# EasyEDA Pro project 136khz_RX_2025-06-18.epro

# Schematic mianSch
Board Name: mianPCB; Create Date: 2025-06-06; Page Name: P1; Project Name: 136khz RX; Schematic Name: mianSch; Update Date: 2025-06-14; Company: 嘉立创EDA; Drawed: BH3PTS; Page Size: A4; Version: V1.0
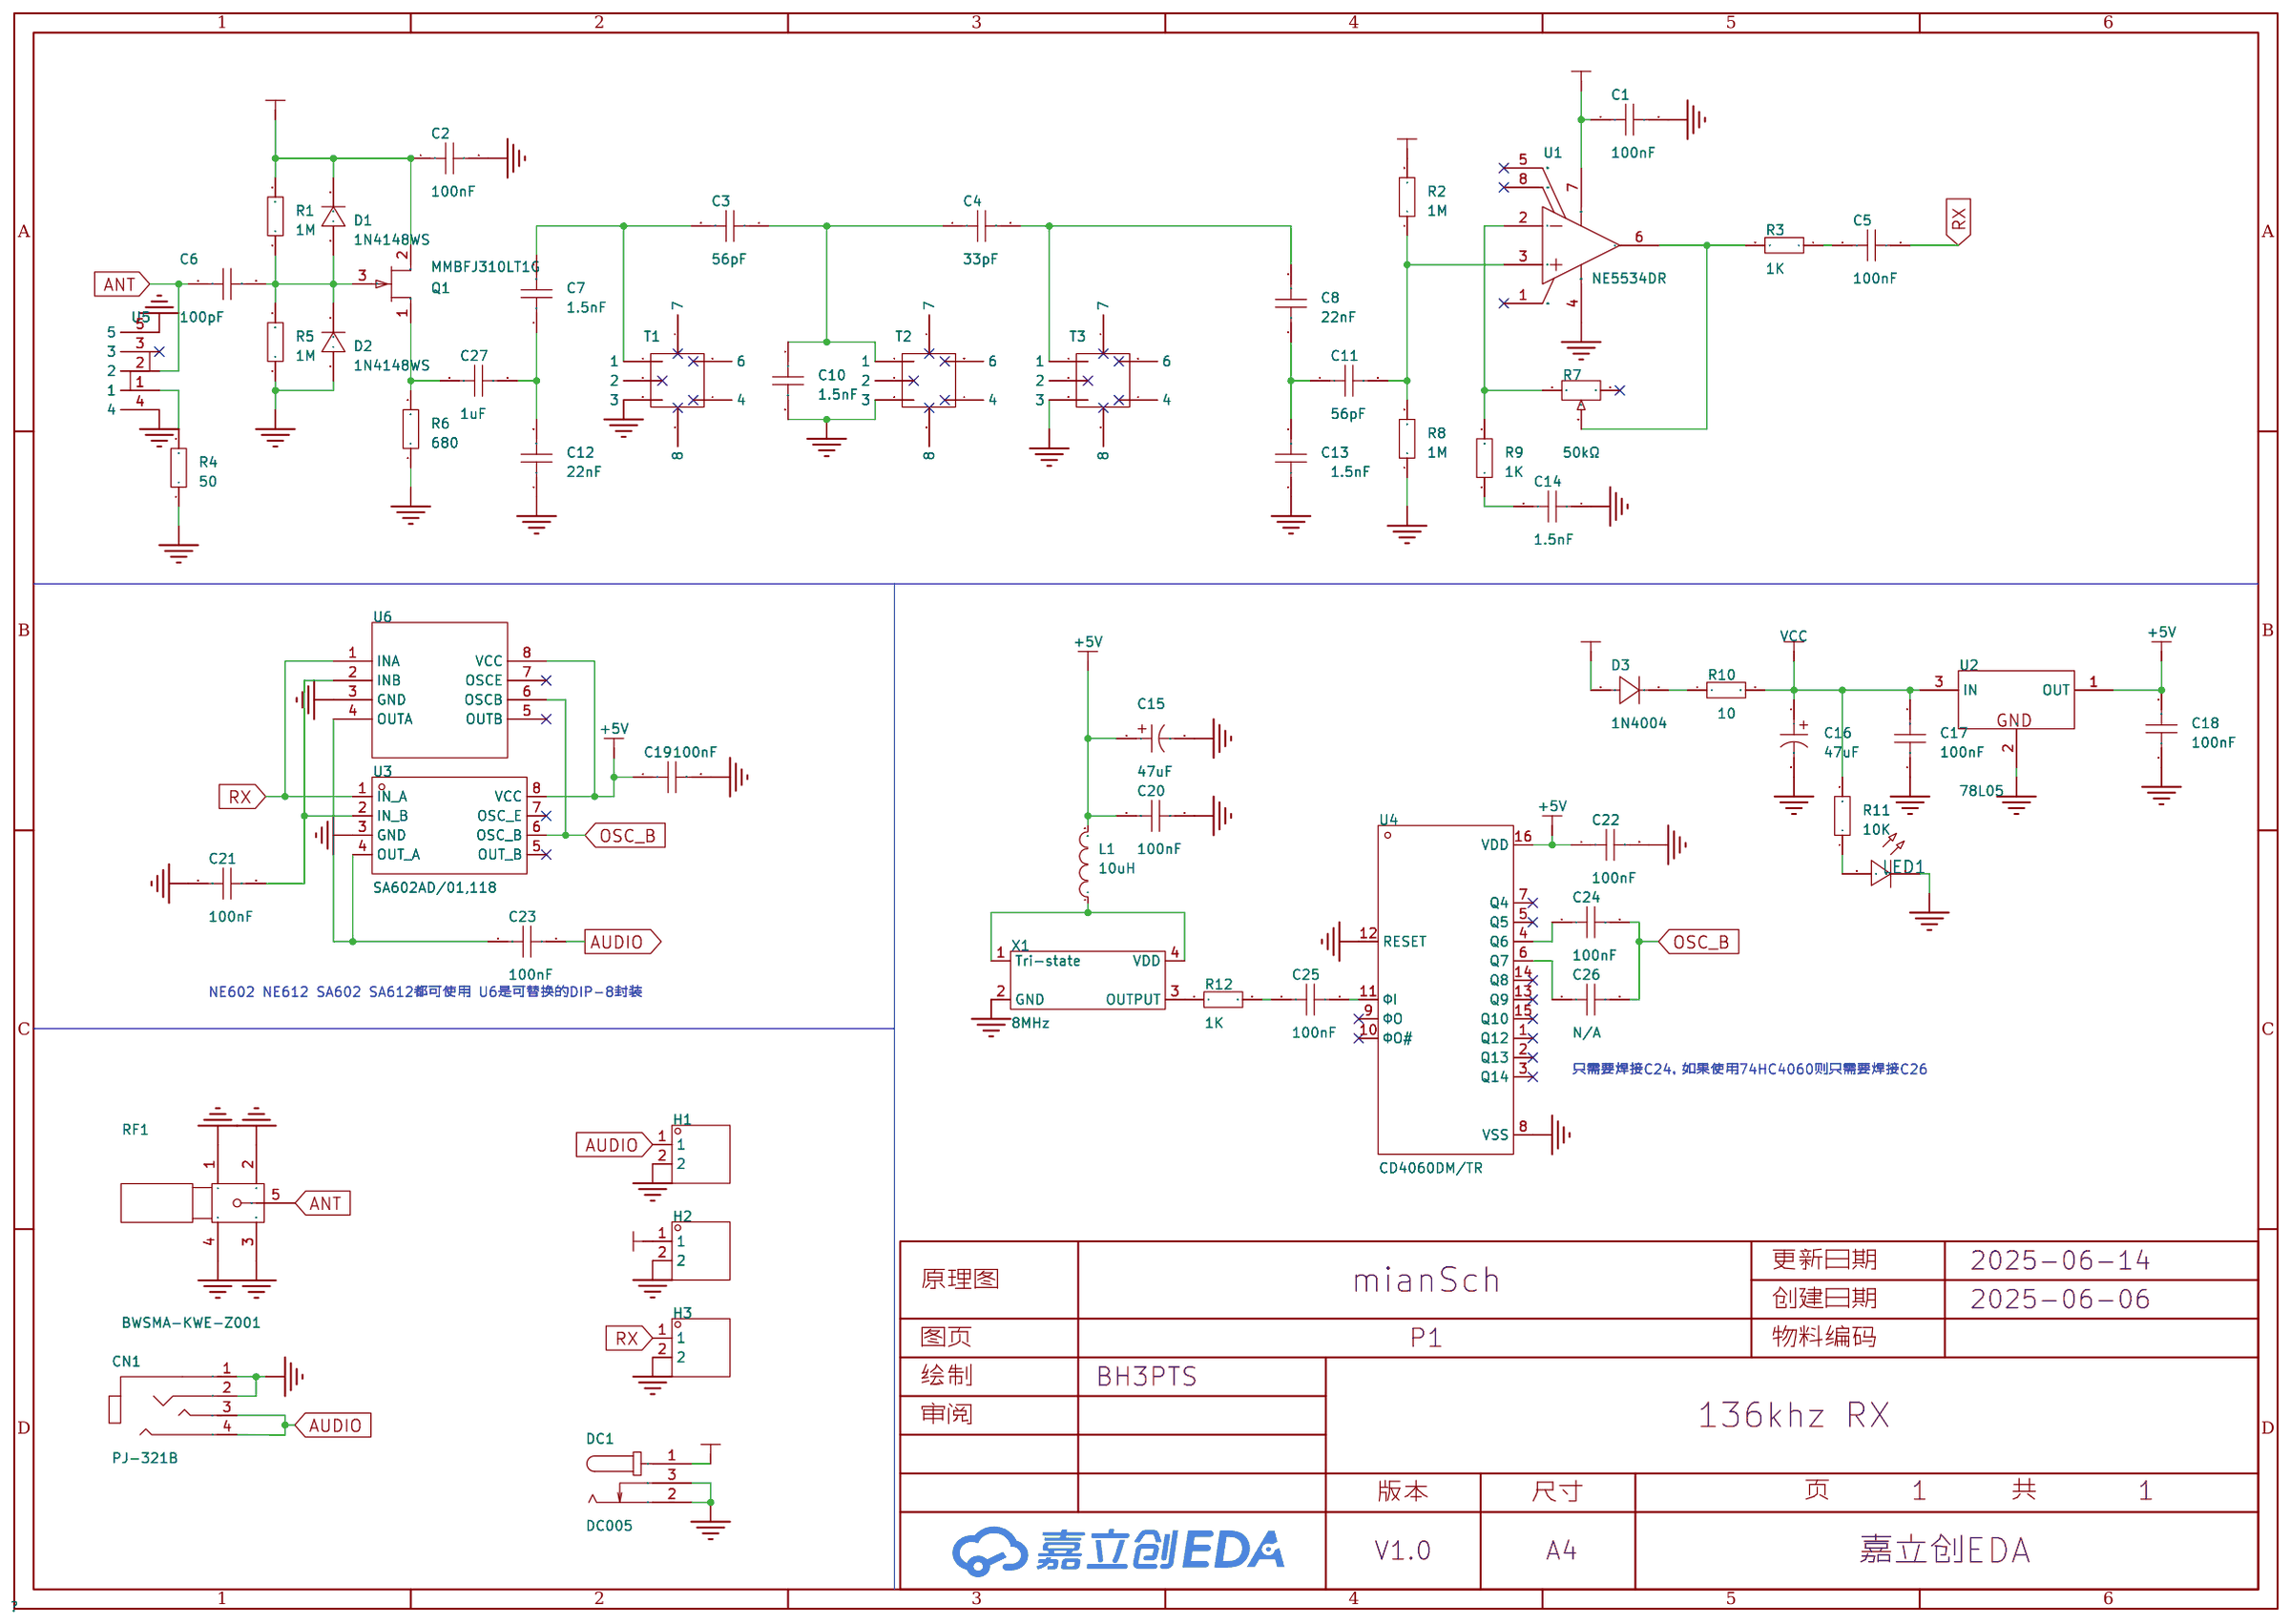
[diagram p0: schematic sheet]

## Parts
C1  100nF  [C0603]
C2  100nF  [C0603]
C3  56pF  [C0603]
C4  33pF  [C0603]
C5  100nF  [C0603]
C6  100pF  [C0603]
C7  1.5nF  [C0603]
C8  22nF  [C0603]
C10  1.5nF  [C0603]
C11  56pF  [C0603]
C12  22nF  [C0603]
C13  1.5nF  [C0603]
C14  1.5nF  [C0603]
C15  47uF  [CAP-SMD_BD6.3-L6.6-W6.6-LS7.2-FD]
C16  47uF  [CAP-SMD_BD6.3-L6.6-W6.6-LS7.2-FD]
C17  100nF  [C0603]
C18  100nF  [C0603]
C19  100nF  [C0603]
C20  100nF  [C0603]
C21  100nF  [C0603]
C22  100nF  [C0603]
C23  100nF  [C0603]
C24  100nF  [C0603]
C25  100nF  [C0603]
C26  N/A  [C0603]
C27  1uF  [C0805]
CN1  PJ-321B  [AUDIO-TH_PJ-321B]
D1  1N4148WS  [SOD-323_L1.8-W1.3-LS2.5-RD]
D2  1N4148WS  [SOD-323_L1.8-W1.3-LS2.5-RD]
D3  1N4004  [SMA_L4.4-W2.8-LS5.4-RD]
DC1  DC005  [DC-IN-TH_DC005]
H1  -  [HDR-TH_2P-P2.54-V-M-1]
H2  -  [HDR-TH_2P-P2.54-V-M-1]
H3  -  [HDR-TH_2P-P2.54-V-M-1]
L1  10uH  [L0603]
LED1  -  [LED_0603]
Q1  MMBFJ310LT1G  [SOT-23-3_L2.9-W1.6-P1.90-LS2.8-BR]
R1  1M  [R0603]
R2  1M  [R0603]
R3  1K  [R0603]
R4  50  [R0805]
R5  1M  [R0603]
R6  680  [R0603]
R7  50kΩ  [RES-ADJ-TH_3P-L7.1-W6.9-P2.50-L_3362P]
R8  1M  [R0603]
R9  1K  [R0603]
R10  10  [R1206]
R11  10K  [R0603]
R12  1K  [R0603]
RF1  BWSMA-KWE-Z001  [SMA-TH_BWSMA-KWE-Z001]
T1  -  [TP702]
T2  -  [TP702]
T3  -  [TP702]
U1  NE5534DR  [SOIC-8_L5.0-W4.0-P1.27-LS6.0-BL]
U2  78L05  [SOT-89-3_L4.5-W2.5-P1.50-LS4.2-BR]
U3  SA602AD/01,118  [SOP-8_L4.9-W3.9-P1.27-LS6.0-BL]
U4  CD4060DM/TR  [SOP-16_L9.9-W3.9-P1.27-LS6.0-BL]
U5  -  [SS-12D07G3]
U6  -  [DIP-8_L9.2-W6.4-P2.54-LS7.6-BL]
X1  8MHz  [OSC-SMD_4P-L3.2-W2.5-BL]

## Library data of the parts
C1-C8 C10-C14 C17-C26 = CAP_0603: Supplier Footprint: 0603
C15 C16 = RVT47UF35V67RV0039: 容值:47uF;精度:±20%;额定电压:35V;纹波电流:16.4mA@120Hz;等效串联电阻(ESR):-;; LCSC Part Name: 47uF ±20% 35V; Supplier Part: C2836440; Manufacturer: KNSCHA(科尼盛); Supplier Footprint: SMD,D6.3xL5.4mm; JLCPCB Part Class: 扩展库; Datasheet: https://atta.szlcsc.com/upload/public/pdf/source/20210528/C2836440_FB61BB3A7A46B9CC2A608A35871DBF0C.pdf; Supplier: LCSC; Tolerance: ±20%; Voltage Rating: 35V; Ripple Current: 16.4mA@120Hz; Diameter: 6.3mm; Height - Seated (Max): 5.4mm; Lifetime: 2000hrs@105℃; Operating Temperature: -55℃~+105℃
C27 = CAP_0805: Supplier Footprint: 0805
CN1 = PJ-321B: 连接器类型:3.5mm耳机座;额定电流:500mA;额定电压:30V;工作温度范围:-20℃~+70℃;焊接温度(最大值):235℃;; LCSC Part Name: 3.5mm耳机座; Supplier Part: C692436; Manufacturer: XKB Connection(中国星坤); Supplier Footprint: 插件; JLCPCB Part Class: 扩展库; Datasheet: https://atta.szlcsc.com/upload/public/pdf/source/20211011/0B12C1EC3FF575692CC2E8C172D7F9F9.pdf; Supplier: LCSC; Connector Type: 3.5mm耳机座; Current Rating (Max): 500mA; Voltage Rating (Max): 30V; Operating Temperature Range: -20℃~+70℃; Soldering Temperature(Max): 235℃
D1 D2 = 1N4148WS_C2128: 二极管配置:独立式;正向压降(Vf):1.25V@150mA;直流反向耐压(Vr):100V;整流电流:150mA;反向恢复时间(trr):4ns;; LCSC Part Name: 电压:100V 电流:150mA; Supplier Part: C2128; Manufacturer: CJ(江苏长电/长晶); Supplier Footprint: SOD-323; JLCPCB Part Class: 基础库; Datasheet: https://atta.szlcsc.com/upload/public/pdf/source/20140809/1457707208178.pdf; Supplier: LCSC; Diode Configuration: 独立式; Forward Voltage (Vf@If): 1.25V@150mA; Reverse Voltage (Vr): 100V; Rectified Current: 150mA; Reverse Leakage Current: 1uA@75V; Reverse Recovery Time (trr): 4ns
D3 = 1N4004_C727080: 二极管配置:独立式;正向压降(Vf):1.1V@1A;直流反向耐压(Vr):400V;整流电流:1A;; LCSC Part Name: 电压:400V 电流:1A; Supplier Part: C727080; Manufacturer: TWGMC(台湾迪嘉); Supplier Footprint: SMA(DO-214AC); JLCPCB Part Class: 扩展库; Datasheet: https://atta.szlcsc.com/upload/public/pdf/source/20200828/C727079_3A05254382567072883400655AE0ED46.pdf; Supplier: LCSC; Diode Configuration: 独立式; Forward Voltage (Vf@If): 1.1V@1A; Reverse Voltage (Vr): 400V; Rectified Current: 1A; Reverse Leakage Current: 5uA
DC1 = DC005: 连接器类型:DC电源插座;安装方式:弯插;触点内径:2mm;触点外径:6.3mm;额定电流:500mA;额定电压:30V;工作温度范围:-25℃~+70℃;; LCSC Part Name: DC电源插座 内径:2mm 外径:6.3mm; Supplier Part: C431533; Manufacturer: SHOU HAN(首韩); Supplier Footprint: 插件; JLCPCB Part Class: 扩展库; Datasheet: https://atta.szlcsc.com/upload/public/pdf/source/20190925/C431533_4751811035784AC1D38EBC85F7905E99.pdf; Supplier: LCSC; Connector Type: DC电源插座; Mounting Style: 弯插; Inside Contact Diameter: 2mm; Outside Contact Diameter: 6.3mm; Current Rating (Max): 500mA; Voltage Rating (Max): 30V; Operating Temperature Range: -25℃~+70℃
H1-H3 = HDR-M_2.54_1x2P: Supplier Part: C124375; Supplier Footprint: 插件
L1 = SDFL1608S100KTF: 电感值:10uH;精度:±10%;额定电流:3mA;饱和电流(Isat):-;直流电阻(DCR):1.85Ω;; LCSC Part Name: 10uH ±10%; Supplier Part: C1035; Manufacturer: Sunlord(顺络); Supplier Footprint: 0603; JLCPCB Part Class: 基础库; Datasheet: https://atta.szlcsc.com/upload/public/pdf/source/20231027/097A17DDB71564CE812E62F0F80142C9.pdf; Supplier: LCSC; Tolerance: ±10%; Rated Current: 3mA; DC Resistance(DCR): 1.85Ω; Q @ Frequency: 30@2MHz; Frequency - Self Resonant: 17MHz
LED1 = LED_0603-R: Supplier Footprint: 0603
Q1 = MMBFJ310LT1G: FET类型:N沟道;栅源击穿电压(V(BR)GSS):-;功率(Pd):-;漏源导通电阻(RDS(on)):-;饱和漏源电流(Idss@Vds,Vgs=0):-;; Supplier Part: C33416; Manufacturer: onsemi(安森美); Supplier Footprint: SOT-23; JLCPCB Part Class: 扩展库; Datasheet: https://atta.szlcsc.com/upload/public/pdf/source/20150912/1457707362458.pdf; Supplier: LCSC; FET Type: N沟道
R1-R3 R5 R6 R8 R9 R11 R12 = Res_0603: Supplier Footprint: 0603
R4 = Res_0805: Supplier Footprint: 0805
R7 = 3362P-1-503: 阻值:50kΩ;精度:±10%;; LCSC Part Name: 50kΩ ±10%; Supplier Part: C118910; Manufacturer: BOCHEN(博晨); Supplier Footprint: 插件; JLCPCB Part Class: 扩展库; Datasheet: https://atta.szlcsc.com/upload/public/pdf/source/20171114/C118910_15106326554621117400.pdf; Supplier: LCSC; Tolerance: ±10%
R10 = Res_1206: Supplier Footprint: 1206
RF1 = BWSMA-KWE-Z001: 连接器类型:板端;接口类型:内孔;端口数量:1;接口直径:5.3mm;接口长度/高度:-;频率-最大值:-;射频系列:SMA;阻抗:50Ω;样式:弯头;触头材质:-;触头镀层:-;工作温度范围:-;焊接温度(最大值):-;; LCSC Part Name: 内孔 SMA 弯头; Supplier Part: C496551; Manufacturer: BAT WIRELESS(蝙蝠无线); Supplier Footprint: 插件; JLCPCB Part Class: 扩展库; Datasheet: https://atta.szlcsc.com/upload/public/pdf/source/20231017/997A8C2ADA7F8034A89BE1264F38CE52.pdf; Supplier: LCSC; Connector Type: 板端; Interface Type: 内孔; Number of Ports: 1; Interface Diameter: 5.3mm; RF Series: SMA; Impedance: 50Ω; Style: 弯头
T1-T3 = TP702
U1 = NE5534DR: 放大器数:单路;轨到轨:-;增益带宽积(GBP):-;输入失调电压(Vos):4mV;压摆率(SR):13V/us;输入偏置电流(Ib):1.5uA;; Supplier Part: C9916; Manufacturer: TI(德州仪器); Supplier Footprint: SOIC-8; JLCPCB Part Class: 扩展库; Datasheet: https://www.ti.com/cn/lit/gpn/ne5534; Supplier: LCSC; Number of Channels: 单路; Maximum Power Supply Range (Vdd-Vss): 40V; Vos - Input Offset Voltage: 4mV; Slew Rate: 13V/us; Ib - Input Bias Current: 1.5uA; Noise density(eN): 3.5nV/√Hz@1kHz; Common Mode Rejection Ratio(CMRR): 100dB; Operating Temperature: 0℃~+70℃; Dual Supply: -20V~-3V；3V~20V
U2 = 78L05_C347258: 输出类型:固定;最大输入电压:30V;输出电压:5V;输出电流:100mA;电源纹波抑制比(PSRR):49dB@(120Hz);输出极性:正极;; LCSC Part Name: 输入30V 输出5V 100mA; Supplier Part: C347258; Manufacturer: UMW(友台半导体); Supplier Footprint: SOT-89-3; JLCPCB Part Class: 扩展库; Datasheet: https://atta.szlcsc.com/upload/public/pdf/source/20231109/E3DE607B64FB2BED1580456949804217.pdf; Supplier: LCSC; Output Type: 固定; Maximum Input Voltage: 30V; Output Voltage: 5V; Output Current: 100mA; Power Supply Rejection Ratio (PSRR): 49dB@(120Hz); Dropout Voltage: 1.7V@(40mA); standby current: 5.5mA; Feature: 短路保护；热保护(TSD)；过流保护(OCP); Operating Temperature: -20℃~+120℃@(Tj); Output Polarity: 正极; Number of Outputs: 1
U3 = SA602AD/01,118: 应用领域:手机；VHF；UHF；HF;频率范围:-;增益:17dB;噪声系数:5dB;; LCSC Part Name: 低功率甚高频单片双平衡混频器 停产; Supplier Part: C2654478; Manufacturer: NXP(恩智浦); Supplier Footprint: SOP-8-150mil; JLCPCB Part Class: 扩展库; Datasheet: https://atta.szlcsc.com/upload/public/pdf/source/20221014/190B59545D7657A86F05EDB4BDCB605B.pdf; Supplier: LCSC; Applications: 手机；VHF；UHF；HF; Gain: 17dB; Noise Figure: 5dB; Supply Voltage: 4.5V~8V; Supply Current: 2.4mA
U4 = CD4060DM/TR: CD4000系列  CMOS 14 级纹波进位二进制计数器/除法器和振荡器; Supplier Part: C7432175; Manufacturer: HGSEMI(华冠); Supplier Footprint: SOP-16; JLCPCB Part Class: 扩展库; Datasheet: https://atta.szlcsc.com/upload/public/pdf/source/20240403/5FE65FFD0C289D102C0D0155CADC53F0.pdf; Supplier: LCSC; Logic Type: 二进制计数器
U5 = SS-12D07G3: 3脚2档 柄高3MM
U6 = NE602 DIP-8: Manufacturer: ddsddp-; Supplier: 淘宝-
X1 = OH2EL89CFI-111YLC-8M: 频率:8MHz;常温频差:±10ppm;输出模式:CMOS;工作电压:5V;频率稳定度:±20ppm;; LCSC Part Name: YSO130HR 8MHZ 4P 3225 5.0V FS±30PPM -40~85℃ CMOS; Supplier Part: C42448898; Manufacturer: YXC(扬兴晶振); Supplier Footprint: SMD3225-4P; Datasheet: https://atta.szlcsc.com/upload/public/pdf/source/20250122/DEEEEA58ECB5341A899DD4C4AB77A06D.pdf; Supplier: LCSC; Normal temperature Frequency Tolerance: ±10ppm; Output Type: CMOS; Voltage - Supply: 5V; Frequency Stability: ±20ppm; Operating Temperature: -40℃~+85℃

## Nets
+5V: C15.1 C18.2 C19.1 C20.2 C22.1 L1.2 U2.1(OUT) U3.8(VCC) U4.16(VDD) U6.8(VCC)
GND: C1.2 C2.2 C10.2 C12.1 C13.1 C14.1 C15.2 C16.2 C17.1 C18.1 C19.2 C20.1 C21.1 C22.2 CN1.1 CN1.2 D2.2(A) DC1.2 DC1.3 H1.2 H2.2 H3.2 LED1.1(C) R4.1 R5.1 R6.1 R8.1 RF1.1 RF1.2 RF1.3 RF1.4 T1.3 T2.3 T3.3 U1.4(VCC-) U2.2(GND) U3.3(GND) U4.8(VSS) U4.12(RESET) U5.4 U5.5 U6.3(GND) X1.2(GND)
VCC: C1.1 C2.1 C16.1 C17.2 D1.1(K) Q1.2(S) R1.2 R2.2 R10.2 R11.2 U1.7(VCC+) U2.3(IN)
VIN: D3.2(A) DC1.1 H2.1
ANT: C6.1 RF1.5 U5.2
AUDIO: C23.1 CN1.3 CN1.4 H1.1
OSC_B: C24.2 C26.2 U3.6(OSC_B) U6.6(OSCB)
RX: C5.2 H3.1 U3.1(IN_A) U6.1(INA)
Net-(C3-1): C3.1 C4.1 C10.1 T2.1
Net-(C3-2): C3.2 C7.2 T1.1
Net-(C4-2): C4.2 C8.2 T3.1
Net-(C5-1): C5.1 R3.1
Net-(C6-2): C6.2 D1.2(A) D2.1(K) Q1.3(G) R1.1 R5.2
Net-(C7-1): C7.1 C12.2 C27.2
Net-(C8-1): C8.1 C11.1 C13.2
Net-(C11-2): C11.2 R2.1 R8.2 U1.3(IN+)
Net-(C14-2): C14.2 R9.1
Net-(C21-2): C21.2 U3.2(IN_B) U6.2(INB)
Net-(C23-2): C23.2 U3.4(OUT_A) U6.4(OUTA)
Net-(C24-1): C24.1 U4.4(Q6)
Net-(C25-1): C25.1 R12.2
Net-(C25-2): C25.2 U4.11(ФI)
Net-(C26-1): C26.1 U4.6(Q7)
Net-(C27-1): C27.1 Q1.1(D) R6.2
Net-(D3-1): D3.1(K) R10.1
Net-(L1-1): L1.1 X1.1(Tri-state) X1.4(VDD)
Net-(LED1-2): LED1.2(A) R11.1
Net-(R3-2): R3.2 R7.2 U1.6(OUT)
Net-(R4-2): R4.2 U5.1
Net-(R7-3): R7.3 R9.2 U1.2(IN-)
Net-(R12-1): R12.1 X1.3(OUTPUT)

Not connected (* = marked no-connect by the designer): R7 1*; T1 2* 4* 6* 7* 8*; T2 2* 4* 6* 7* 8*; T3 2* 4* 6* 7* 8*; U1 1(BALANCE)* 5(COMP)* 8(COMPBAL)*; U3 5(OUT_B)* 7(OSC_E)*; U4 1(Q12)* 2(Q13)* 3(Q14)* 5(Q5)* 7(Q4)* 9(ФO)* 10(ФO#)* 13(Q9)* 14(Q8)* 15(Q10)*; U5 3*; U6 5(OUTB)* 7(OSCE)*

## Notes on the sheet
- NE602 NE612 SA602 SA612都可使用 U6是可替换的DIP-8封装
- 只需要焊接C24，如果使用74HC4060则只需要焊接C26

# Board mainBroad
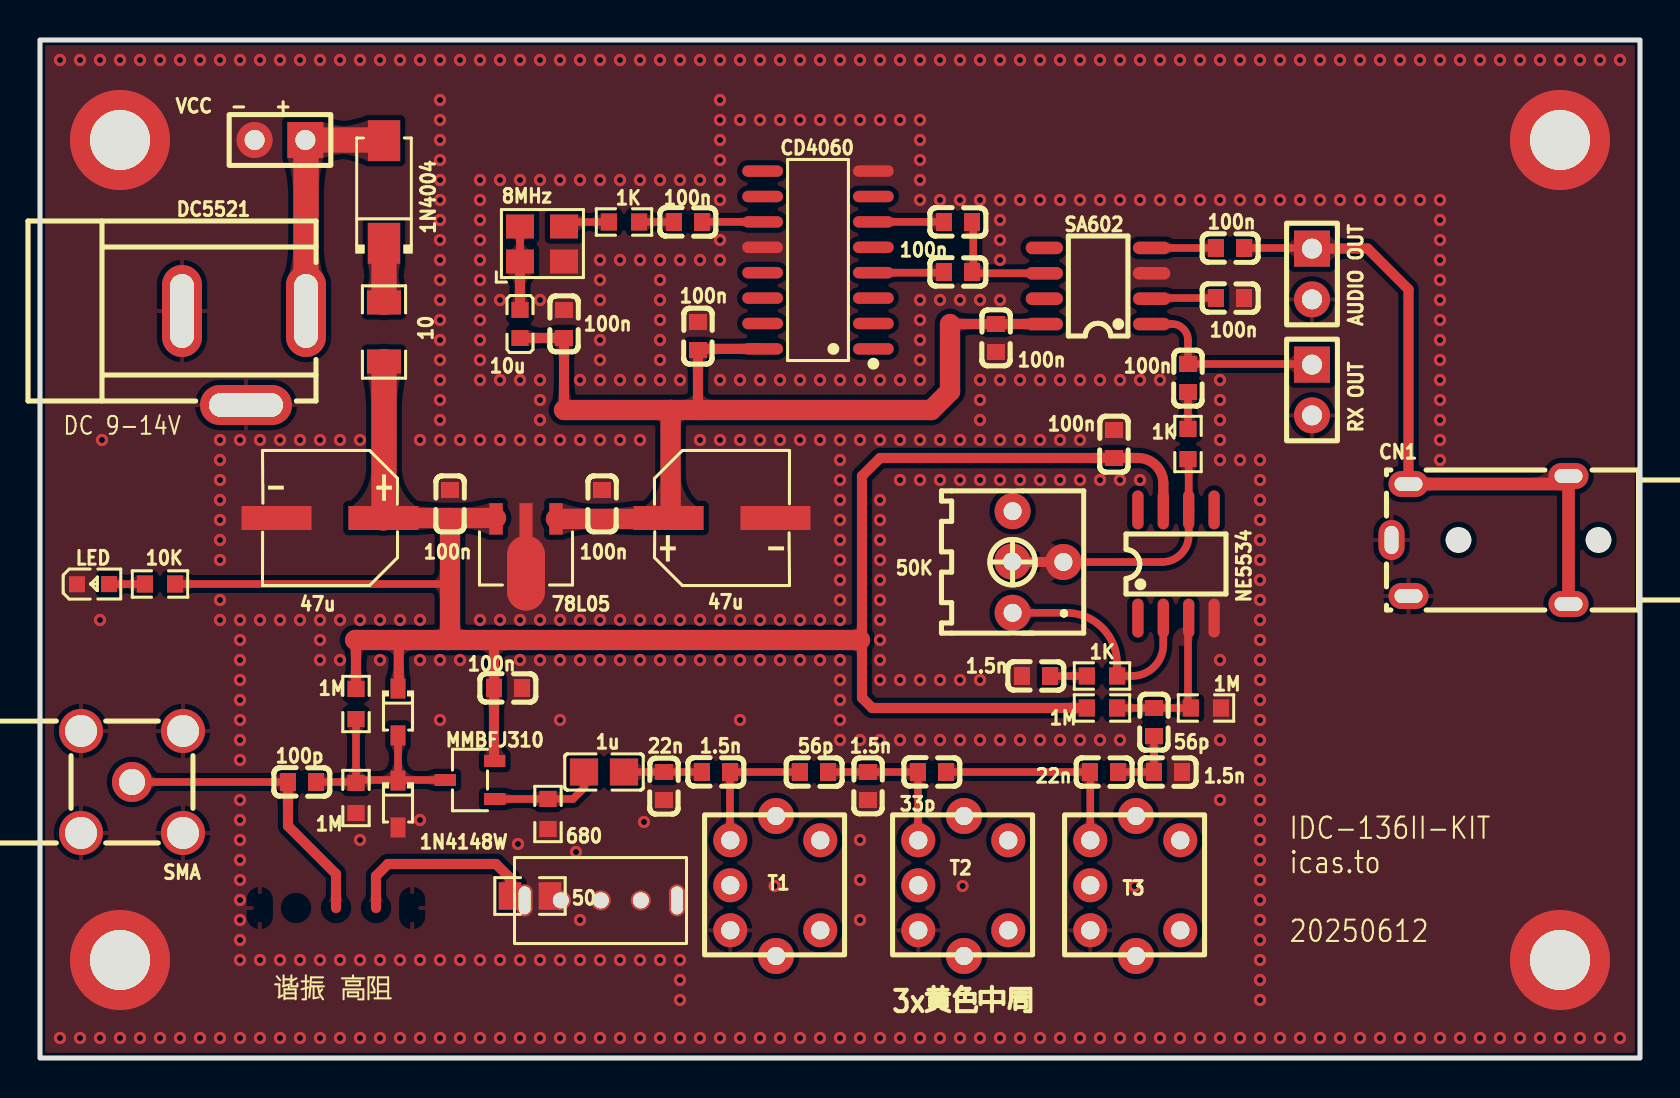
[diagram p1: board, top side]
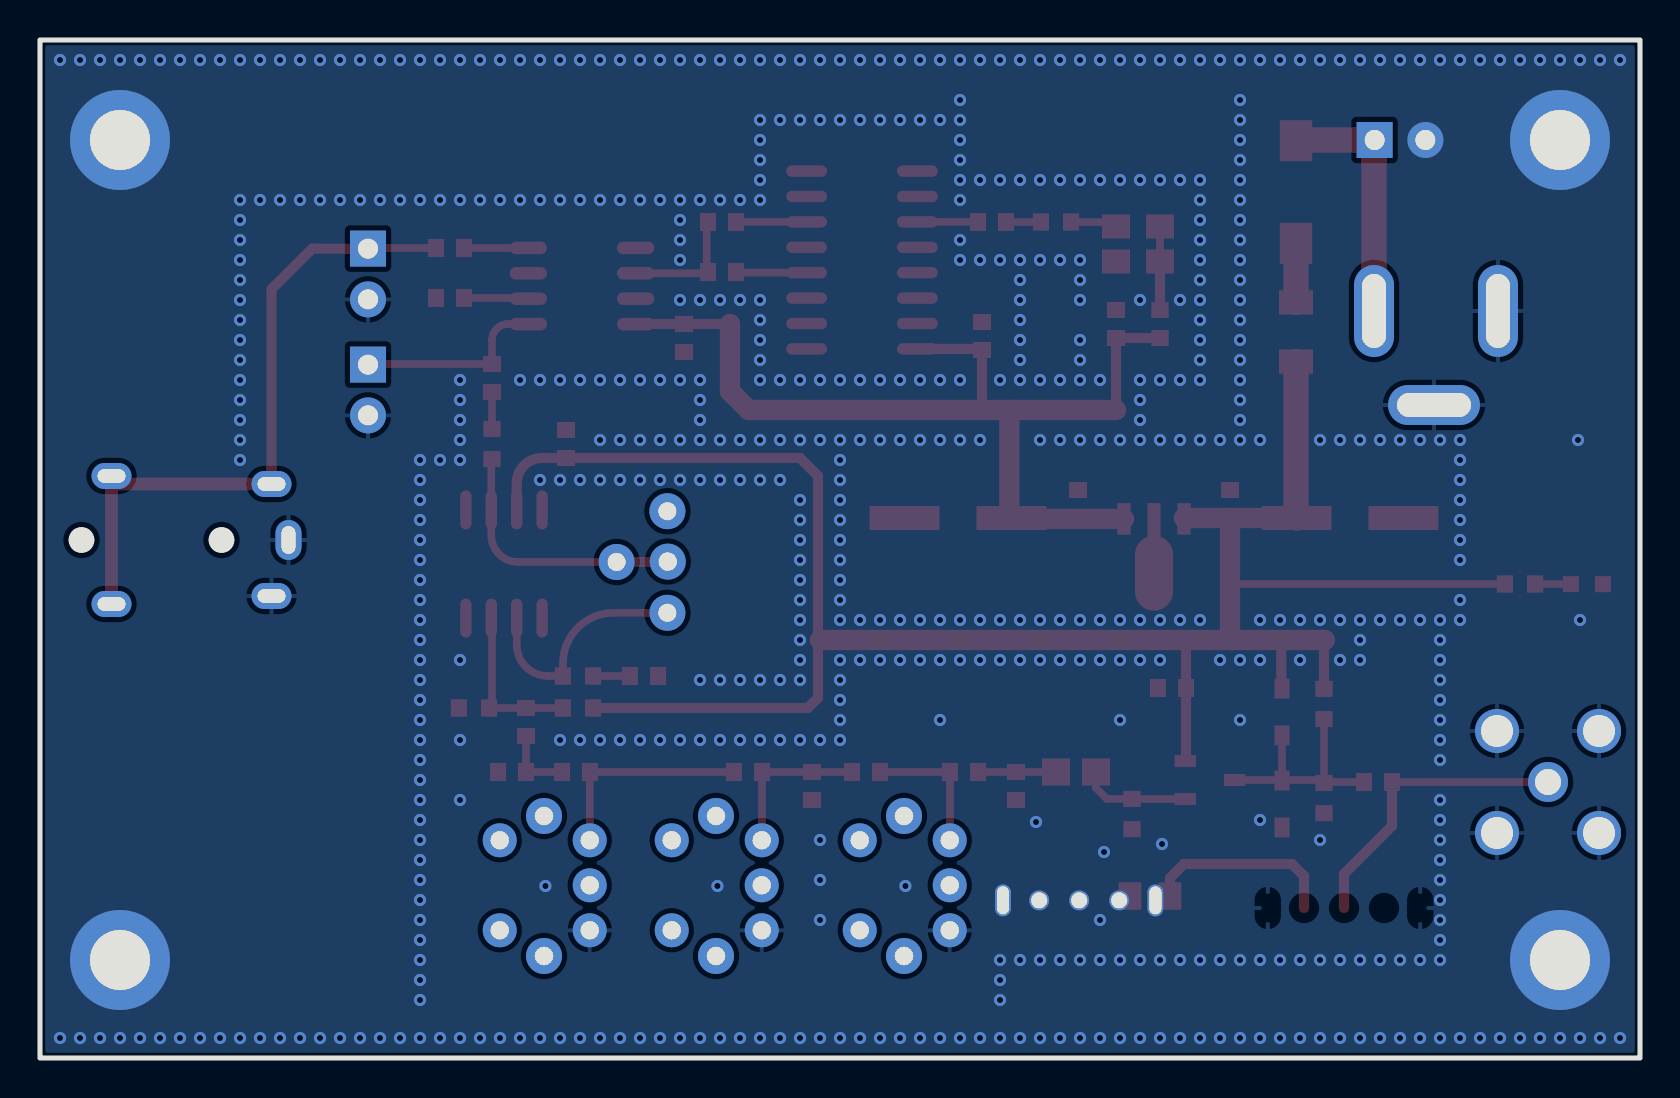
[diagram p2: board, bottom side, seen from below]

Outline 80 x 50.9 mm; copper layers: Top Layer, Bottom Layer. Coordinates in mm from the lower left corner of the outline.
Outline path: rectangle 0,50.9 80,0
Stack: Top Layer 0.035mm / Dielectric1 1.51mm FR4 er 4.5 / Bottom Layer 0.035mm

## Design rules (mm)
template: 自定义配置
spacing copperThickness1oz (default): track to track 0.102, other pairs 0.152 to 0.3
spacing copperThickness2oz: track to track 0.203, other pairs 0.152 to 0.3
track width copperThickness1oz (default): min 0.127, default 0.254, max 2.54
track width copperThickness2oz: min 0.203, default 0.254, max 2.54
differential pair differentialPair (default): width min 0.127, default 0.254, max 2.54; gap min 0.152, default 0.152
via viaSize (default): diameter min 0.5, default 0.61, max 10; hole min 0.3, default 0.305, max 6.299
net GND uses copperRegion1
pour e3013 uses copperRegion1

## Placement (name value [footprint] x y rotation side)
1.5n  -  [C0603]  49.8 19.1 0 top
1.5n#2  -  [C0603]  33.8 14.3 0 top
1.5n#3  -  [C0603]  41.4 13.6 270 top
1.5n#4  -  [C0603]  56.4 14.3 180 top
1K  -  [R0603]  53.1 19.1 0 top
1K#2  -  [R0603]  57.4 30.7 270 top
1K#3  -  [R0603]  29.2 41.8 0 top
1M  -  [R0603]  15.8 17.7 90 top
1M#2  -  [R0603]  15.8 13 90 top
1M#3  -  [R0603]  53.1 17.5 180 top
1M#4  -  [R0603]  58.3 17.5 180 top
1N4004  1N4004  [SMA_L4.4-W2.8-LS5.4-RD]  17.2 43.3 90 top
1N4148W  1N4148WS  [SOD-323_L1.8-W1.3-LS2.5-RD]  17.9 12.7 270 top
1u  1uF  [C0805]  28.2 14.3 0 top
8MHz  8MHz  [OSC-SMD_4P-L3.2-W2.5-BL]  25.1 40.7 0 top
10  100  [R1206]  17.2 36.3 270 top
10K  1K  [R0603]  6 23.7 0 top
10u  10uH  [L0603]  24 36.7 270 top
22n  -  [C0603]  31.2 13.6 90 top
22n#2  -  [C0603]  53.2 14.3 180 top
33p  33pF  [C0603]  44.6 14.3 0 top
47u  -  [CAP-SMD_BD6.3-L6.6-W6.6-LS7.2-FD]  34.1 27 0 top
47u#2  -  [CAP-SMD_BD6.3-L6.6-W6.6-LS7.2-FD]  14.5 27 180 top
50  50  [R0805]  24.5 8.1 180 top
50K  50kΩ  [RES-ADJ-TH_3P-L7.1-W6.9-P2.50-L_3362P]  49.9 24.8 270 top
56p  -  [C0603]  38.7 14.3 180 top
56p#2  -  [C0603]  55.7 16.8 90 top
78L05  78L05  [SOT-89-3_L4.5-W2.5-P1.50-LS4.2-BR]  24.3 25.6 90 top
100n  -  [C0603]  57.4 34 90 top
100n#2  -  [C0603]  23.4 18.5 0 top
100n#3  -  [C0603]  53.7 30.7 90 top
100n#4  -  [C0603]  47.8 36 270 top
100n#5  -  [C0603]  59.5 38 180 top
100n#6  -  [C0603]  59.5 40.5 180 top
100n#7  -  [C0603]  20.5 27.7 270 top
100n#8  -  [C0603]  28.1 27.7 270 top
100n#9  -  [C0603]  32.9 36.1 90 top
100n#10  -  [C0603]  45.9 39.3 0 top
100n#11  -  [C0603]  32.4 41.8 0 top
100n#12  -  [C0603]  26.2 36.7 270 top
100p  100pF  [C0603]  13.1 13.8 0 top
680  680  [R0603]  25.4 12.2 90 top
AUDIO OUT  -  [HDR-TH_2P-P2.54-V-M-1]  63.6 39.2 270 top
C26  N/A  [C0603]  45.9 41.8 0 top
CD4060  CD4060DM/TR  [SOP-16_L9.9-W3.9-P1.27-LS6.0-BL]  38.9 39.9 90 top
CN1  PJ-321B  [AUDIO-TH_PJ-321B]  72 25.9 0 top
D1  1N4148WS  [SOD-323_L1.8-W1.3-LS2.5-RD]  17.9 17.3 270 top
DC5521  DC005  [DC-IN-TH_DC005]  10.2 35 0 top
LED  -  [LED_0603]  2.7 23.7 0 top
MMBFJ310  MMBFJ310LT1G  [SOT-23-3_L2.9-W1.6-P1.90-LS2.8-BR]  21.5 13.9 0 top
NE5534  NE5534DR  [SOIC-8_L5.0-W4.0-P1.27-LS6.0-BL]  56.8 24.7 0 top
NOREF  -  [Pad_e14]  48.61 24.82 0 top
NOREF#2  -  [Pad_e1405]  4 45.9 0 top
NOREF#3  -  [Pad_e318]  76 45.9 0 top
NOREF#4  -  [Pad_e316]  76 4.9 0 top
NOREF#5  -  [Pad_e319]  4 4.9 0 top
RX OUT  -  [HDR-TH_2P-P2.54-V-M-1]  63.6 33.4 270 top
SA602  SA602AD/01,118  [SOP-8_L4.9-W3.9-P1.27-LS6.0-BL]  52.9 38.6 90 top
SMA  BWSMA-KWE-Z001  [SMA-TH_BWSMA-KWE-Z001]  4.6 13.8 180 top
T1  -  [TP702]  36.8 8.6 270 top
T2  -  [TP702]  46.2 8.6 270 top
T3  -  [TP702]  54.8 8.6 270 top
U5  -  [SS-12D07G3]  14.8 7.5 180 top
VCC  -   +  -  [HDR-TH_2P-P2.54-V-M-1]  12 45.9 180 top

## Footprints (pads in the part's own frame, mm; a bottom-side part is the same pattern mirrored in y, then rotated)
AUDIO-TH_PJ-321B
  oval 1.3x2 hole 0.7x1.4: 1(-4.425,0)
  oval 2x1.3 hole 1.4x0.7: 2(-3.575,-2.8) 3(-3.575,2.8) 4(4.425,3.2) 4(4.425,-3.2)
C0603
  rect 0.8x0.9 smd: 1(-0.7,0) 2(0.7,0)
C0805
  rect 1.41x1.35 smd: 1(-1,0) 2(1,0)
CAP-SMD_BD6.3-L6.6-W6.6-LS7.2-FD
  rect 3.5x1.2 smd: 1(-2.67,0) 2(2.67,0)
DC-IN-TH_DC005
  oval 2x4.6 hole 1.2x3.7: 1(3.1,2.35) 2(-3.1,2.35)
  oval 4.6x2 hole 3.7x1.2: 3(0.1,-2.35)
HDR-TH_2P-P2.54-V-M-1
  rect 1.8x1.8 hole 1: 1(-1.27,0)
  round 1.8 hole 1: 2(1.27,0)
L0603
  rect 0.8x0.864 smd: 1(-0.7,0) 2(0.7,0)
LED_0603
  rect 0.8x0.8 smd: 1(-0.851,-0.01) 2(0.75,-0.005)
OSC-SMD_4P-L3.2-W2.5-BL
  rect 1.4x1.2 smd: 1(-1.1,-0.875) 2(1.1,-0.875) 3(1.1,0.875) 4(-1.1,0.875)
Pad_e14
  round 1.8 hole 0.914: 1(0,0)
Pad_e316
  round 5 hole 3: 1(0,0)
Pad_e318
  round 5 hole 3: 1(0,0)
Pad_e319
  round 5 hole 3: 1(0,0)
Pad_e1405
  round 5 hole 3: 1(0,0)
R0603
  rect 0.806x0.864 smd: 1(-0.753,0) 2(0.753,0)
R0805
  rect 1.133x1.377 smd: 1(-1,0) 2(1,0)
R1206
  rect 1.208x1.701 smd: 1(-1.479,0) 2(1.479,0)
RES-ADJ-TH_3P-L7.1-W6.9-P2.50-L_3362P
  round 1.8 hole 0.9: 1(-2.54,-1.27) 2(0,1.27) 3(2.54,-1.27)
SMA-TH_BWSMA-KWE-Z001
  round 2.2 hole 1.6: 1(-2.55,-2.55) 2(-2.55,2.55) 3(2.55,2.55) 4(2.55,-2.55)
  round 2 hole 1.3: 5(0,0)
SMA_L4.4-W2.8-LS5.4-RD
  rect 2.046x1.62 smd: 1(-2.566,0) 2(2.566,0)
SOD-323_L1.8-W1.3-LS2.5-RD
  rect 1x0.75 smd: 1(-1.173,0) 2(1.173,0)
SOIC-8_L5.0-W4.0-P1.27-LS6.0-BL
  oval 0.569x1.95 smd: 1(-1.905,-2.705) 2(-0.635,-2.705) 3(0.635,-2.705) 4(1.905,-2.705) 5(1.905,2.705) 6(0.635,2.705) 7(-0.635,2.705) 8(-1.905,2.705)
SOP-8_L4.9-W3.9-P1.27-LS6.0-BL
  oval 0.63x1.865 smd: 1(-1.905,-2.683) 2(-0.635,-2.683) 3(0.635,-2.683) 4(1.905,-2.683) 5(1.905,2.683) 6(0.635,2.683) 7(-0.635,2.683) 8(-1.905,2.683)
SOP-16_L9.9-W3.9-P1.27-LS6.0-BL
  oval 0.574x2.038 smd: 1(-4.445,-2.769) 2(-3.175,-2.769) 3(-1.905,-2.769) 4(-0.635,-2.769) 5(0.635,-2.769) 6(1.905,-2.769) 7(3.175,-2.769) 8(4.445,-2.769) 9(4.445,2.769) 10(3.175,2.769) 11(1.905,2.769) 12(0.635,2.769) 13(-0.635,2.769) 14(-1.905,2.769) 15(-3.175,2.769) 16(-4.445,2.769)
SOT-23-3_L2.9-W1.6-P1.90-LS2.8-BR
  rect 1.07x0.6 smd: 1(1.235,-0.95) 2(1.235,0.95) 3(-1.235,0)
SOT-89-3_L4.5-W2.5-P1.50-LS4.2-BR
  rect 1.575x0.672 smd: 1(1.356,-1.5) 3(1.356,1.5)
  custom 5.377x1.9 smd: 2(-1.356,0)
SS-12D07G3
  round 1 hole 0.8: 1(-15.24,-0.381) 2(-13.24,-0.381) 3(-11.24,-0.381)
  oval 0.8x1.6 hole 0.6x1.4: 4(-17.05,-0.381) 5(-9.43,-0.381)
TP702
  round 1.7 hole 0.914: 1(-2.286,-2.286) 2(-0.036,-2.286) 3(2.214,-2.286) 4(2.214,2.214) 6(-2.286,2.214)
  round 1.8 hole 0.914: 7(-3.5,0) 8(3.5,0)

## Nets
+5V: 10u.2 47u.1 78L05.1 100n#4.1 100n#8.2 100n#9.1 100n#12.2 CD4060.16 SA602.8
GND: 1.5n.1 1.5n#3.2 1.5n#4.1 1M#2.1 1M#4.1 1N4148W.2 8MHz.2 22n.1 47u.2 47u#2.2 50.1 78L05.2 100n#2.2 100n#3.2 100n#4.2 100n#5.1 100n#7.1 100n#8.1 100n#9.2 100n#12.1 680.1 AUDIO OUT.2 CD4060.8 CD4060.12 CN1.1 CN1.2 DC5521.2 DC5521.3 LED.1 NE5534.4 NOREF#2.1 NOREF#3.1 NOREF#4.1 NOREF#5.1 RX OUT.2 SA602.3 SMA.1 SMA.2 SMA.3 SMA.4 T1.3 T2.3 T3.3 U5.4 U5.5 VCC  -   +.2
VCC: 1M.2 1M#3.2 10.2 10K.2 47u#2.1 78L05.3 100n#2.1 100n#3.1 100n#7.2 D1.1 MMBFJ310.2 NE5534.7
VIN: 1N4004.2 DC5521.1 VCC  -   +.1
ANT: 100p.1 SMA.5 U5.2
AUDIO: 100n#6.1 AUDIO OUT.1 CN1.3 CN1.4
OSC_B: 100n#10.2 C26.2 SA602.6
RX: 100n.2 RX OUT.1 SA602.1
$1N1988: 100n#5.2 SA602.2
$1N2418: 1M.1 1M#2.2 1N4148W.1 100p.2 D1.2 MMBFJ310.3
$1N3341: 100n#11.2 CD4060.11
$1N3862: 100n#10.1 CD4060.4
$1N4488: 100n#6.2 SA602.4
$1N5880: 1M#3.1 1M#4.2 56p#2.2 NE5534.3
$1N6093: 1.5n.2 1K.1
$1N6098: 1K#2.2 50K.2 NE5534.6 NOREF.1
$1N12552: 1.5n#2.1 1u.2 22n.2
$1N12557: 1u.1 680.2 MMBFJ310.1
$1N12793: 1.5n#2.2 56p.2 T1.1
$1N12804: 1.5n#3.1 33p.1 56p.1 T2.1
$1N12830: 22n#2.2 33p.2 T3.1
$1N12956: 1.5n#4.2 22n#2.1 56p#2.1
$1N13183: 1K#2.1 100n.1
$1N13194: 1K.2 50K.3 NE5534.2
$1N13438: C26.1 CD4060.6
$1N14724: 1K#3.2 100n#11.1
$1N14750: 1K#3.1 8MHz.3
$1N15343: 8MHz.1 8MHz.4 10u.1
$1N16118: 10K.1 LED.2
$1N16128: 1N4004.1 10.1
$1N17895: 50.2 U5.1

Pads without a net: 50K 1; CD4060 1 2 3 5 7 9 10 13 14 15; NE5534 1 5 8; SA602 5 7; T1 2 4 6 7 8; T2 2 4 6 7 8; T3 2 4 6 7 8; U5 3

## Via types
v1: diameter 0.61, hole 0.305, Top Layer to Bottom Layer, 569 vias

## Routing (per net, layer and track width the routed paths; a pad name or vN(x,y) marks a point on that pad's centre or on a via; arc(x,y) is an arc through that point)
+5V: length 50.8
  Top Layer w0.508: SA602.8 50.21,36.7 100n#4.1 45.5,36.7 ; 26.2,32.4 100n#12.2 10u.2 ; 32.9,32.4 100n#9.1 32.96,35.46 CD4060.16
  Top Layer w1.016: 31.53,27.1 31.53,32.4 ; 31.53,32.4 26.2,32.4 ; 31.53,32.4 44.56,32.4 45.5,33.34 45.5,36.7 ; 78L05.1 31.39,26.96 47u.1
GND:
  vias: v1(1,49.9) v1(1,1) v1(2,49.9) v1(2,1) v1(3,49.9) v1(3,21.9) v1(3,1) v1(3.1,30.9) v1(4,49.9) v1(4,1) v1(5,49.9) v1(5,1) v1(6,49.9) v1(6,1) v1(7,49.9) v1(7,1) v1(8,49.9) v1(8,1) v1(9,49.9) v1(9,30.9) v1(9,29.9) v1(9,28.9) v1(9,27.9) v1(9,26.9) v1(9,25.9) v1(9,24.9) v1(9,22.9) v1(9,21.9) v1(9,1) v1(10,49.9) v1(10,30.9) v1(10,21.9) v1(10,20.9) v1(10,19.9) v1(10,18.9) v1(10,17.9) v1(10,16.9) v1(10,15.9) v1(10,14.9) v1(10,12.9) v1(10,11.9) v1(10,10.9) v1(10,9.9) v1(10,8.9) v1(10,7.9) v1(10,6.9) v1(10,5.9) v1(10,4.9) v1(10,1) v1(11,49.9) v1(11,30.9) v1(11,21.9) v1(11,4.9) v1(11,1) v1(12,49.9) v1(12,30.9) v1(12,21.9) v1(12,4.9) v1(12,1) v1(13,49.9) v1(13,30.9) v1(13,21.9) v1(13,4.9) v1(13,1) v1(14,49.9) v1(14,30.9) v1(14,21.9) v1(14,20.9) v1(14,19.9) v1(14,4.9) v1(14,1) v1(15,49.9) v1(15,30.9) v1(15,21.9) v1(15,19.9) v1(15,4.9) v1(15,1) v1(16,49.9) v1(16,30.9) v1(16,21.9) v1(16,10.9) v1(16,4.9) v1(16,1) v1(17,49.9) v1(17,21.9) v1(17,19.9) v1(17,4.9) v1(17,1) v1(18,49.9) v1(18,21.9) v1(18,4.9) v1(18,1) v1(19,49.9) v1(19,30.9) v1(19,21.9) v1(19,19.9) v1(19,11.9) v1(19,4.9) v1(19,1) v1(20,49.9) v1(20,47.9) v1(20,46.9) v1(20,45.9) v1(20,44.9) v1(20,43.9) v1(20,42.9) v1(20,41.9) v1(20,40.9) v1(20,39.9) v1(20,38.9) v1(20,37.9) v1(20,36.9) v1(20,35.9) v1(20,34.9) v1(20,33.9) v1(20,32.9) v1(20,31.9) v1(20,30.9) v1(20,19.9) v1(20,16.9) v1(20,4.9) v1(20,1) v1(21,49.9) v1(21,30.9) v1(21,19.9) v1(21,4.9) v1(21,1) v1(22,49.9) v1(22,43.9) v1(22,42.9) v1(22,41.9) v1(22,40.9) v1(22,39.9) v1(22,38.9) v1(22,37.9) v1(22,36.9) v1(22,35.9) v1(22,34.9) v1(22,33.9) v1(22,30.9) v1(22,21.9) v1(22,4.9) v1(22,1) v1(23,49.9) v1(23,43.9) v1(23,37.9) v1(23,33.9) v1(23,30.9) v1(23,21.9) v1(23,4.9) v1(23,1) v1(23.9,10.7) v1(24,49.9) v1(24,43.9) v1(24,33.9) v1(24,30.9) v1(24,21.9) v1(24,19.9) v1(24,4.9) v1(24,1) v1(25,49.9) v1(25,43.9) v1(25,37.9) v1(25,33.9) v1(25,32.9) v1(25,31.9) v1(25,30.9) v1(25,21.9) v1(25,19.9) v1(25,4.9) v1(25,1) v1(26,49.9) v1(26,43.9) v1(26,30.9) v1(26,21.9) v1(26,19.9) v1(26,16.9) v1(26,4.9) v1(26,1) v1(26.8,10.3) v1(27,49.9) v1(27,43.9) v1(27,33.9) v1(27,30.9) v1(27,21.9) v1(27,19.9) v1(27,6.9) v1(27,4.9) v1(27,1) v1(28,49.9) v1(28,43.9) v1(28,39.9) v1(28,38.9) v1(28,37.9) v1(28,35.9) v1(28,34.9) v1(28,33.9) v1(28,30.9) v1(28,21.9) v1(28,19.9) v1(28,4.9) v1(28,1) v1(29,49.9) v1(29,43.9) v1(29,39.9) v1(29,33.9) v1(29,30.9) v1(29,21.9) v1(29,19.9) v1(29,4.9) v1(29,1) v1(30,49.9) v1(30,43.9) v1(30,39.9) v1(30,33.9) v1(30,30.9) v1(30,21.9) v1(30,19.9) v1(30,4.9) v1(30,1) v1(30.2,11.8) v1(31,49.9) v1(31,43.9) v1(31,39.9) v1(31,38.9) v1(31,37.9) v1(31,36.9) v1(31,35.9) v1(31,34.9) v1(31,33.9) v1(31,21.9) v1(31,19.9) v1(31,4.9) v1(31,1) v1(32,49.9) v1(32,43.9) v1(32,39.9) v1(32,33.9) v1(32,21.9) v1(32,19.9) v1(32,4.9) v1(32,3.9) v1(32,2.9) v1(32,1) v1(33,49.9) v1(33,43.9) v1(33,39.9) v1(33,30.9) v1(33,21.9) v1(33,19.9) v1(33,1) v1(34,49.9) v1(34,47.9) v1(34,46.9) v1(34,45.9) v1(34,44.9) v1(34,43.9) v1(34,42.9) v1(34,40.9) v1(34,39.9) v1(34,33.9) v1(34,30.9) v1(34,21.9) v1(34,19.9) v1(34,1) v1(35,49.9) v1(35,46.9) v1(35,33.9) v1(35,30.9) v1(35,21.9) v1(35,19.9) v1(35,16.9) v1(35,1) v1(36,49.9) v1(36,46.9) v1(36,33.9) v1(36,30.9) v1(36,21.9) v1(36,19.9) v1(36,1) v1(36.73,8.6) v1(37,49.9) v1(37,46.9) v1(37,33.9) v1(37,30.9) v1(37,21.9) v1(37,19.9) v1(37,1) v1(38,49.9) v1(38,46.9) v1(38,33.9) v1(38,30.9) v1(38,21.9) v1(38,19.9) v1(38,1) v1(39,49.9) v1(39,46.9) v1(39,33.9) v1(39,30.9) v1(39,21.9) v1(39,19.9) v1(39,1) v1(40,49.9) v1(40,46.9) v1(40,33.9) v1(40,30.9) v1(40,29.9) v1(40,28.9) v1(40,27.9) v1(40,26.9) v1(40,25.9) v1(40,24.9) v1(40,23.9) v1(40,22.9) v1(40,21.9) v1(40,19.9) v1(40,18.9) v1(40,17.9) v1(40,16.9) v1(40,15.9) v1(40,1) v1(41,49.9) v1(41,46.9) v1(41,33.9) v1(41,30.9) v1(41,15.9) v1(41,10.9) v1(41,8.9) v1(41,6.9) v1(41,1) v1(42,49.9) v1(42,46.9) v1(42,33.9) v1(42,30.9) v1(42,27.9) v1(42,26.9) v1(42,25.9) v1(42,24.9) v1(42,23.9) v1(42,22.9) v1(42,21.9) v1(42,20.9) v1(42,19.9) v1(42,18.9) v1(42,15.9) v1(42,1) v1(43,49.9) v1(43,46.9) v1(43,33.9) v1(43,30.9) v1(43,28.9) v1(43,18.9) v1(43,15.9) v1(43,1) v1(44,49.9) v1(44,46.9) v1(44,45.9) v1(44,44.9) v1(44,43.9) v1(44,42.9) v1(44,37.9) v1(44,36.9) v1(44,35.9) v1(44,34.9) v1(44,33.9) v1(44,30.9) v1(44,28.9) v1(44,18.9) v1(44,15.9) v1(44,1) v1(45,49.9) v1(45,42.9) v1(45,37.9) v1(45,30.9) v1(45,28.9) v1(45,18.9) v1(45,15.9) v1(45,1) v1(46,49.9) v1(46,42.9) v1(46,37.9) v1(46,30.9) v1(46,28.9) v1(46,18.9) v1(46,15.9) v1(46,1) v1(46.13,8.6) v1(47,49.9) v1(47,42.9) v1(47,37.9) v1(47,33.9) v1(47,32.9) v1(47,31.9) v1(47,30.9) v1(47,28.9) v1(47,18.9) v1(47,15.9) v1(47,1) v1(48,49.9) v1(48,42.9) v1(48,41.9) v1(48,40.9) v1(48,39.9) v1(48,37.9) v1(48,33.9) v1(48,30.9) v1(48,28.9) v1(48,15.9) v1(48,1) v1(49,49.9) v1(49,42.9) v1(49,33.9) v1(49,30.9) v1(49,28.9) v1(49,15.9) v1(49,1) v1(50,49.9) v1(50,42.9) v1(50,33.9) v1(50,30.9) v1(50,28.9) v1(50,15.9) v1(50,1) v1(51,49.9) v1(51,42.9) v1(51,33.9) v1(51,30.9) v1(51,28.9) v1(51,15.9) v1(51,1) v1(52,49.9) v1(52,42.9) v1(52,33.9) v1(52,30.9) v1(52,28.9) v1(52,15.9) v1(52,1) v1(53,49.9) v1(53,42.9) v1(53,33.9) v1(53,28.9) v1(53,15.9) v1(53,1) v1(54,49.9) v1(54,42.9) v1(54,33.9) v1(54,28.9) v1(54,15.9) v1(54,1) v1(54.73,8.6) v1(55,49.9) v1(55,42.9) v1(55,33.9) v1(55,28.9) v1(55,1) v1(56,49.9) v1(56,42.9) v1(56,33.9) v1(56,1) v1(57,49.9) v1(57,42.9) v1(57,1) v1(58,49.9) v1(58,42.9) v1(58,1) v1(59,49.9) v1(59,42.9) v1(59,33.9) v1(59,32.9) v1(59,31.9) v1(59,30.9) v1(59,29.9) v1(59,19.9) v1(59,15.9) v1(59,12.9) v1(59,1) v1(60,49.9) v1(60,42.9) v1(60,29.9) v1(60,1) v1(61,49.9) v1(61,42.9) v1(61,29.9) v1(61,28.9) v1(61,27.9) v1(61,26.9) v1(61,25.9) v1(61,24.9) v1(61,23.9) v1(61,22.9) v1(61,21.9) v1(61,20.9) v1(61,19.9) v1(61,18.9) v1(61,17.9) v1(61,16.9) v1(61,15.9) v1(61,14.9) v1(61,13.9) v1(61,12.9) v1(61,11.9) v1(61,10.9) v1(61,9.9) v1(61,8.9) v1(61,7.9) v1(61,6.9) v1(61,5.9) v1(61,4.9) v1(61,3.9) v1(61,2.9) v1(61,1) v1(62,49.9) v1(62,42.9) v1(62,1) v1(63,49.9) v1(63,42.9) v1(63,1) v1(64,49.9) v1(64,42.9) v1(64,1) v1(65,49.9) v1(65,42.9) v1(65,1) v1(66,49.9) v1(66,42.9) v1(66,1) v1(67,49.9) v1(67,42.9) v1(67,1) v1(68,49.9) v1(68,42.9) v1(68,1) v1(69,49.9) v1(69,42.9) v1(69,1) v1(70,49.9) v1(70,42.9) v1(70,41.9) v1(70,40.9) v1(70,39.9) v1(70,38.9) v1(70,37.9) v1(70,36.9) v1(70,35.9) v1(70,34.9) v1(70,33.9) v1(70,32.9) v1(70,31.9) v1(70,30.9) v1(70,29.9) v1(70,1) v1(71,49.9) v1(71,1) v1(72,49.9) v1(72,1) v1(73,49.9) v1(73,1) v1(74,49.9) v1(74,1) v1(75,49.9) v1(75,1) v1(76,49.9) v1(76,1) v1(77,49.9) v1(77,1) v1(78,49.9) v1(78,1) v1(79,49.9) v1(79,1)
VCC: length 109.5
  Top Layer w0.381: 20.5,23.7 20.5,23.7 10K.2
  Top Layer w0.508: 22.7,20.9 100n#2.1 22.7,14.89 arc(22.71,14.86) MMBFJ310.2 ; 41,21 41.1,20.9 41.1,18.01 41.61,17.5 1M#3.2 ; 17.94,20.9 17.94,18.51 arc(17.93,18.48) D1.1 ; 56.16,27.41 56.16,28.73 arc(55.79,29.63) 54.9,30 100n#3.1 42,30 41.1,29.1 41.1,21.1 ; 1M.2 15.8,20.9
  Top Layer w1.016: 20.41,20.9 15.76,20.9 ; 20.41,20.9 20.5,20.99 100n#7.2 ; 20.41,20.9 41,20.9 ; 100n#7.2 22.8,27 ; 100n#7.2 47u#2.1
  Top Layer w1.27: 10.2 17.2,27.03 47u#2.1
VIN: length 12.5
  Top Layer w1.27: 1N4004.2 17.17,45.9 VCC  -   +.1 13.3,45.87 DC5521.1
ANT: length 15
  Top Layer w0.381: SMA.5 12.35,13.8
  Top Layer w0.508: 14.8,7.5 14.8,9.2 12.4,11.6 100p.1
AUDIO: length 33.4
  Top Layer w0.381: 100n#6.1 63.57,40.5 arc(63.59,40.49) AUDIO OUT.1
  Top Layer w0.508: AUDIO OUT.1 66.39,40.47 68.43,38.43 CN1.3
  Top Layer w0.635: CN1.3 76.03,28.7 CN1.4 CN1.4
OSC_B: length 6.2
  Top Layer w0.381: 46.66,39.23 100n#10.2 ; 46.66,39.23 SA602.6 ; 46.66,39.23 46.66,41.73 C26.2
RX: length 9.7
  Top Layer w0.381: SA602.1 arc(55.58,36.7) 55.59,36.7 56.6,36.7 arc(57.17,36.47) 57.4,35.9 100n.2 63.57,34.7 arc(63.59,34.69) RX OUT.1
$1N1988: length 3.2
  Top Layer w0.381: 55.61,38 58.79,38 ; 58.78,37.98 58.82,38.02
$1N2418: length 11.9
  Top Layer w0.381: 16,13.9 16,13.91 ; 16,13.9 15.91,13.9 ; 16,13.9 17.89,13.9 ; 16,13.9 16,13.9 ; 20.29,13.89 20.31,13.91 ; 15.84,13.96 15.95,13.85 ; 15.95,13.85 15.95,13.86 ; 15.95,13.85 15.95,13.84 ; 15.95,13.85 15.84,13.75 ; 15.78,13.82 15.82,13.78 ; D1.2 1N4148W.1 ; 13.82,13.8 15.78,13.8 ; 15.8,16.98 15.8,14.02 ; 16,13.81 16,13.8 ; 17.93,13.9 20.27,13.9
$1N3341: length 3
  Top Layer w0.381: CD4060.11 33.1,41.81 100n#11.2
$1N3862: length 3.5
  Top Layer w0.381: 100n#10.1 45.16,39.27 CD4060.4
$1N4488: length 3.2
  Top Layer w0.381: 100n#6.2 58.81,40.5 ; 100n#6.2 58.8,40.5 ; 100n#6.2 58.8,40.5 ; 100n#6.2 55.59,40.5
$1N5880: length 8.2
  Top Layer w0.381: 57.52,17.5 53.88,17.5 ; 57.4,21.99 57.4,17.61 ; 57.44,17.66 57.56,17.54
$1N6093: length 1.8
  Top Layer w0.381: 50.48,19.1 52.32,19.1
$1N6098: length 13.5
  Top Layer w0.381: 50K.2 56.1,24.8 arc(57.04,25.19) 57.44,26.14 NE5534.6 57.44,29.88 arc(57.45,29.93) 57.5,29.95 ; 57.47,27.37 arc(57.51,27.39) 57.53,27.43
  Top Layer w0.508: NOREF.1 48.63,24.8 50K.2
$1N12552: length 3.9
  Top Layer w0.381: 1.5n#2.1 22n.2 1u.2
$1N12557: length 5.5
  Top Layer w0.381: 1u.1 27.2,13.5 26.65,12.95 680.2 25.4,12.95 MMBFJ310.1
$1N12793: length 6.9
  Top Layer w0.381: 56p.2 1.5n#2.2 34.5,10.9 T1.1
$1N12804: length 7.9
  Top Layer w0.381: 56p.1 1.5n#3.1 33p.1 43.9,10.9 T2.1
$1N12830: length 10.6
  Top Layer w0.381: 33p.2 22n#2.2 52.51,14.29 T3.1
$1N12956: length 3.6
  Top Layer w0.381: 22n#2.1 1.5n#4.2 56p#2.1
$1N13183: length 1.8
  Top Layer w0.381: 1K#2.1 100n.1
$1N13194: length 11.8
  Top Layer w0.381: 56.16,22 56.16,20.67 arc(55.71,19.56) 54.6,19.1 1K.2 53.85,19.72 arc(53.11,21.52) 51.31,22.26 50K.3
$1N13438: length 3.5
  Top Layer w0.381: CD4060.6 45.19,41.81 C26.1
$1N14724: length 1.7
  Top Layer w0.381: 100n#11.1 1K#3.2
$1N14750: length 2.3
  Top Layer w0.381: 1K#3.1 26.43,41.8 8MHz.3
$1N15343: length 4.2
  Top Layer w0.381: 8MHz.1 8MHz.4
  Top Layer w0.508: 8MHz.1 10u.1
$1N16118: length 1.8
  Top Layer w0.381: LED.2 5.24,23.7 arc(5.25,23.7) 10K.1
$1N16128: length 3
  Top Layer w1.27: 1N4004.1 10.1
$1N17895: length 9.7
  Top Layer w0.508: 50.2 23.5,9 22.8,9.7 17.4,9.7 16.8,9.1 16.8,7.5

## Copper pours and planes (outline as drawn; the poured copper is in the pictures)
GND on Top Layer: -4,52.2 83.7,52.2 83.7,-1.7 -4,-1.7
GND on Bottom Layer: -4.8,51.9 82.9,51.9 82.9,-2 -4.8,-2

Small or netless copper shapes (teardrops, artwork), in the pictures only: 144 on Top Layer

## Text on the board
Top Silkscreen Layer: DC 9-14V | IDC-136II-KIT / icas.to / 20250612 | 谐振 高阻 | 3x黄色中周
